# EAGLE schematic exlemon (EAGLE 9.2.2)
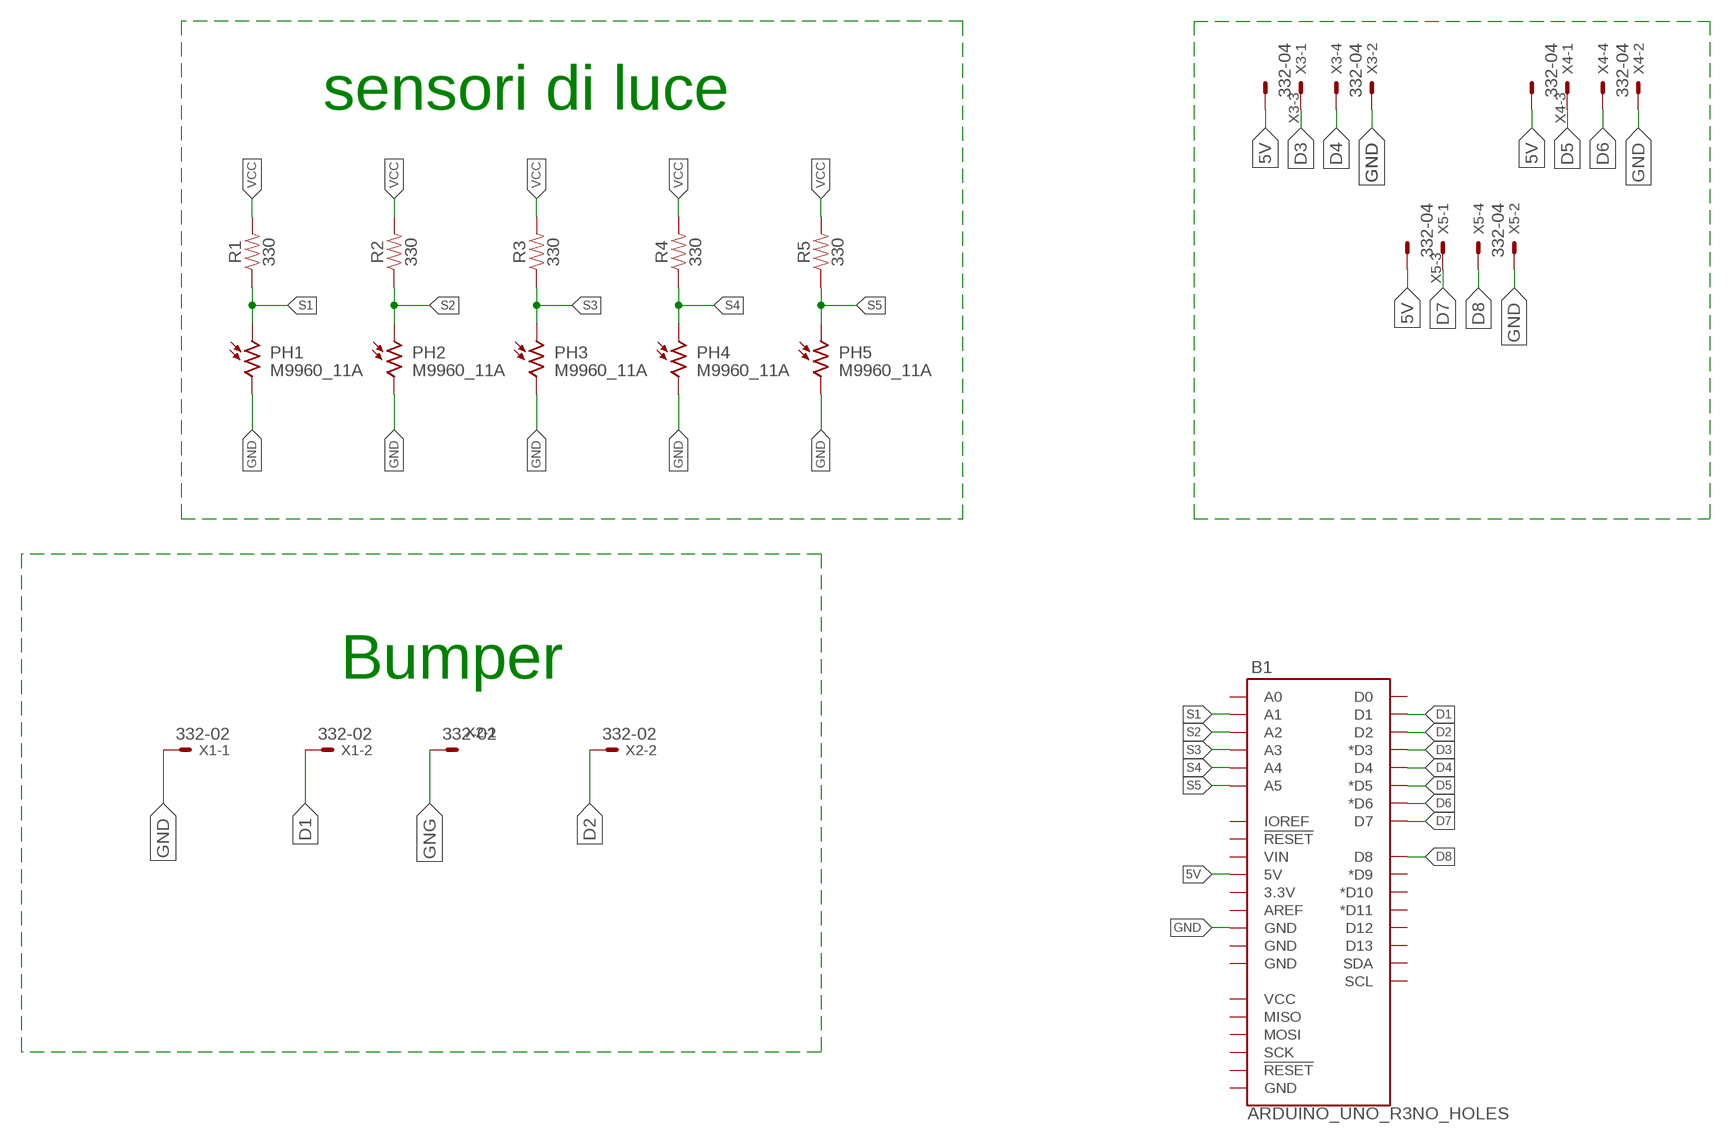
[diagram p0: schematic, sheet 1]

## Parts
B1  ARDUINO_UNO_R3NO_HOLES  [ARDUINO_R3_NO_HOLES]
PH1  M9960_11A  [M9960]
PH2  M9960_11A  [M9960]
PH3  M9960_11A  [M9960]
PH4  M9960_11A  [M9960]
PH5  M9960_11A  [M9960]
R1  330  330OHM-HORIZ-1/10W-5%  [AXIAL-0.3]
R2  330  330OHM-HORIZ-1/10W-5%  [AXIAL-0.3]
R3  330  330OHM-HORIZ-1/10W-5%  [AXIAL-0.3]
R4  330  330OHM-HORIZ-1/10W-5%  [AXIAL-0.3]
R5  330  330OHM-HORIZ-1/10W-5%  [AXIAL-0.3]
X1  332-02  [332-02]
X2  332-02  [332-02]
X3  332-04  [332-04]
X4  332-04  [332-04]
X5  332-04  [332-04]

## Nets
5V: B1.5V X3.3 X4.3 X5.3
D1: B1.D1 X1.2
D2: B1.D2 X2.2
D3: B1.D3(*D3) X3.1
D4: B1.D4 X3.4
D5: B1.D5(*D5) X4.1
D6: B1.D6(*D6) X4.4
D7: B1.D7 X5.1
D8: B1.D8 X5.4
GND: B1.GND@4(GND) PH1.2 PH2.2 PH3.2 PH4.2 PH5.2 X1.1 X3.2 X5.2
GNG: X2.1
N$9: X4.2
S1: B1.A1 PH1.1 R1.P$1
S2: B1.A2 PH2.1 R2.P$1
S3: B1.A3 PH3.1 R3.P$1
S4: B1.A4 PH4.1 R4.P$1
S5: B1.A5 PH5.1 R5.P$1
VCC: R1.P$2 R2.P$2 R3.P$2 R4.P$2 R5.P$2
Unconnected: B1.3.3V B1.A0 B1.AREF B1.D0 B1.D9(*D9) B1.D10(*D10) B1.D11(*D11) B1.D12 B1.D13 B1.GND@1(GND) B1.GND@2(GND) B1.GND@3(GND) B1.IOREF B1.MISO B1.MOSI B1.RESET@1(!RESET!) B1.RESET@2(!RESET!) B1.SCK B1.SCL B1.SDA B1.VCC B1.VIN

## Notes on the sheet
- sensori di luce
- Bumper

## Library data of the parts
B1 = SparkFun-Boards:ARDUINO_UNO_R3: Arduino R3 Footprint with SPI header Arduino Uno R3 Compatible Footprint. Matches PCB size of the original board. SparkFun Products: SAMD21 Dev Breakout <https://www.sparkfun.com/products/13672> RedBoard <https://www.sparkfun.com/products/12757> R3 Stackable Headers <https://www.sparkfun.com/products/11417>
PH1-PH5 = photo-elements:M9960_11: Photo Sensor Beacon Light, Photometer Applications Source: http://optoelectronics.perkinelmer.com/content/Datasheets/DTS_M9960.pdf
R1-R5 = SparkFun-Resistors:330OHM: 330Ω resistor A resistor is a passive two-terminal electrical component that implements electrical resistance as a circuit element. Resistors act to reduce current flow, and, at the same time, act to lower voltage levels within circuits. - Wikipedia; PROD_ID: RES-8371
X1 X2 = con-garry:332-02: 2 Pin - 2mm Dual Row Source: www.mpe-connector.de / garry_shortform_2012.pdf
X3-X5 = con-garry:332-04: 4 Pin - 2mm Dual Row Source: www.mpe-connector.de / garry_shortform_2012.pdf